# EAGLE design eindwerk board (EAGLE 9.6.2)
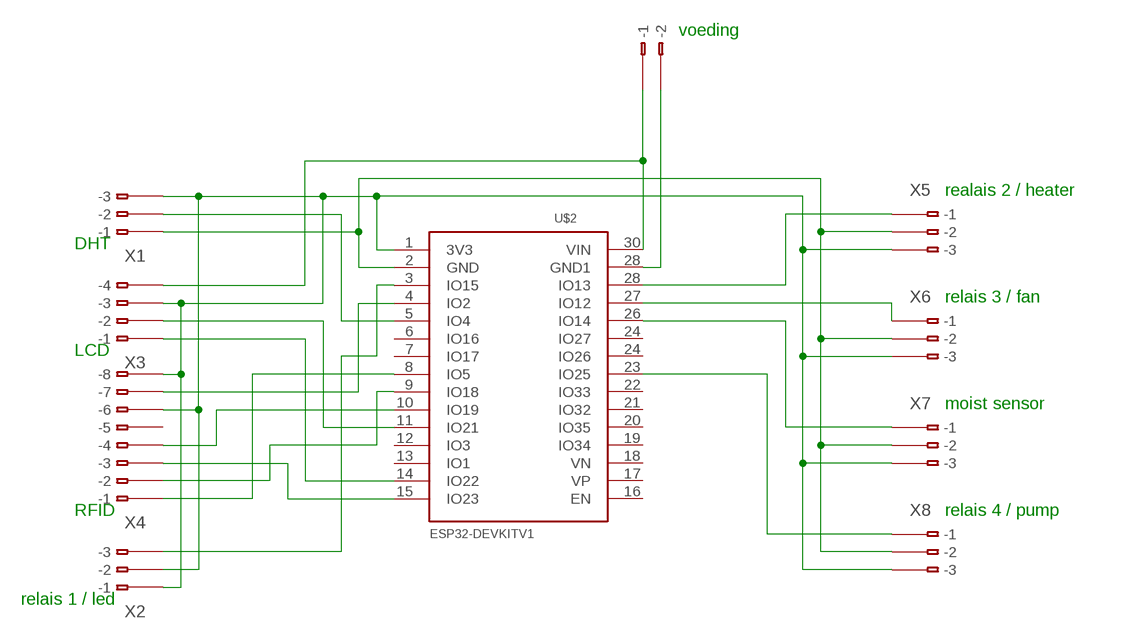
[diagram p0: schematic, sheet 1]

## Parts
U$2  ESP32DEVKITV1  [ESP32-DEVKITV1]
VOEDING  233-102  [233-102]
X1  233-103  [233-103]
X2  233-103  [233-103]
X3  233-104  [233-104]
X4  233-108  [233-108]
X5  233-103  [233-103]
X6  233-103  [233-103]
X7  233-103  [233-103]
X8  233-103  [233-103]

## Nets
N$1: U$2.28(IO13) X5.B1(B-1)
N$2: U$2.2(GND) X1.B1(B-1) X5.B2(B-2) X6.B2(B-2) X7.B2(B-2) X8.B2(B-2)
N$3: U$2.27(IO12) X6.B1(B-1)
N$4: U$2.30(VIN) VOEDING.B1(B-1) X3.B4(B-4)
N$5: U$2.26(IO14) X7.B1(B-1)
N$6: U$2.5(IO4) X1.B2(B-2)
N$7: U$2.4(IO2) X4.B7(B-7)
N$8: U$2.23(IO25) X8.B1(B-1)
N$9: U$2.11(IO21) X3.B2(B-2)
N$10: U$2.14(IO22) X3.B1(B-1)
N$11: U$2.10(IO19) X4.B4(B-4)
N$12: U$2.15(IO23) X4.B3(B-3)
N$13: U$2.9(IO18) X4.B2(B-2)
N$14: U$2.8(IO5) X4.B1(B-1)
N$15: U$2.3(IO15) X2.B3(B-3)
N$16: U$2.1(3V3) X1.B3(B-3) X2.B1(B-1) X2.B2(B-2) X3.B3(B-3) X4.B6(B-6) X4.B8(B-8) X5.B3(B-3) X6.B3(B-3) X7.B3(B-3) X8.B3(B-3)
N$17: U$2.28(GND1) VOEDING.B2(B-2)
Unconnected: U$2.6(IO16) U$2.7(IO17) U$2.12(IO3) U$2.13(IO1) U$2.16(EN) U$2.17(VP) U$2.18(VN) U$2.19(IO34) U$2.20(IO35) U$2.21(IO32) U$2.22(IO33) U$2.24(IO26) U$2.24(IO27) VOEDING.A1(-1) VOEDING.A2(-2) X1.A1(-1) X1.A2(-2) X1.A3(-3) X2.A1(-1) X2.A2(-2) X2.A3(-3) X3.A1(-1) X3.A2(-2) X3.A3(-3) X3.A4(-4) X4.A1(-1) X4.A2(-2) X4.A3(-3) X4.A4(-4) X4.A5(-5) X4.A6(-6) X4.A7(-7) X4.A8(-8) X4.B5(B-5) X5.A1(-1) X5.A2(-2) X5.A3(-3) X6.A1(-1) X6.A2(-2) X6.A3(-3) X7.A1(-1) X7.A2(-2) X7.A3(-3) X8.A1(-1) X8.A2(-2) X8.A3(-3)

## Notes on the sheet
- voeding
- realais 2 / heater
- DHT
- relais 3 / fan
- LCD
- moist sensor
- RFID | relais 4 / pump
- relais 1 / led

## Library data of the parts
U$2 = ESP32-DEVKITV1:ESP32DEVKITV1
VOEDING = con-wago:233-102: WAGO Cage Clamp; MPN: 233-102; OC_FARNELL: unknown; OC_NEWARK: 28K9044
X1 X2 X5-X8 = con-wago:233-103: WAGO Cage Clamp; MPN: 233-103; OC_FARNELL: unknown; OC_NEWARK: 28K9045
X3 = con-wago:233-104: WAGO Cage Clamp; MPN: 233-104; OC_FARNELL: unknown; OC_NEWARK: 28K9046
X4 = con-wago:233-108: WAGO Cage Clamp; MPN: 233-108; OC_FARNELL: unknown; OC_NEWARK: 28K9050

## Board
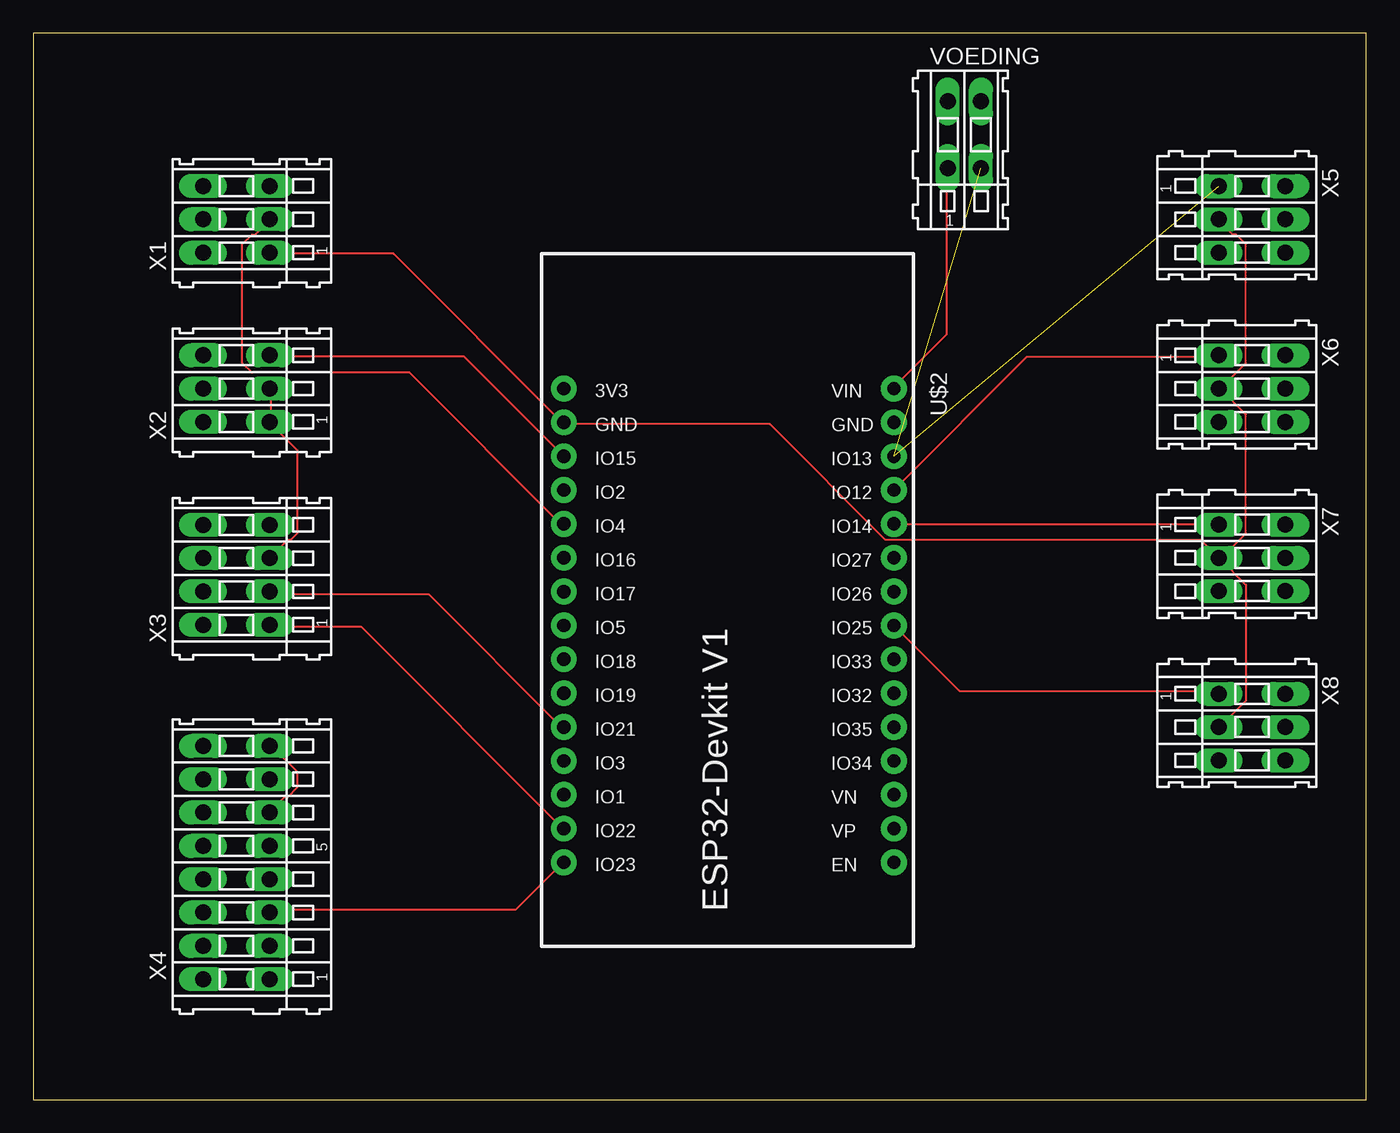
[diagram p1: board, top side]
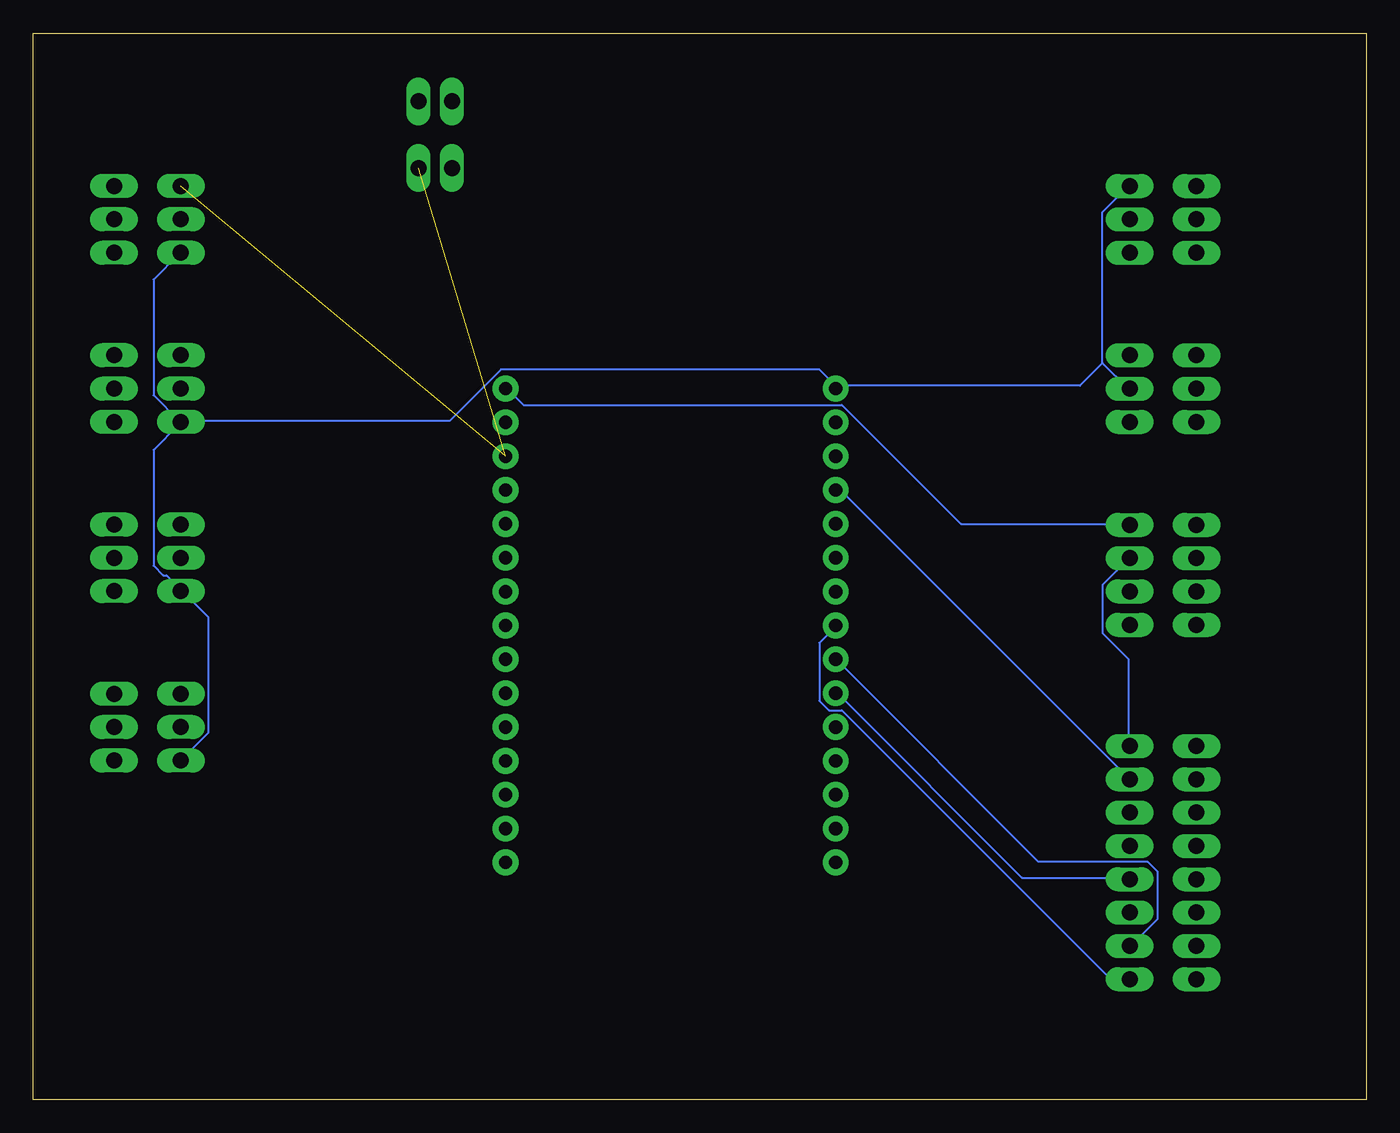
[diagram p2: board, bottom side, seen from below]

Size 100 x 80 mm. Coordinates in mm from the lower left corner, seen from the top.
Outline: 0,0 100,0 100,80 0,80 0,0
Copper layers (1*16): Top 0.035mm / dielectric 1.5mm / Bottom 0.035mm
Design rules "default *": minimum track width 6mil, minimum drill 0.35mm, track to track 13mil, track to pad 6mil, pad to pad 6mil, via to via 6mil, smd to smd 6mil, copper to edge 40mil, drill to drill 6mil, minimum pad ring 10mil, minimum via ring 8mil, stop-mask expansion 4mil, vias tented up to drill 0mil, thermal gap 10mil

### Footprints (pad centres in the part's own frame; a part is rotated, then mirrored left to right if it is on the bottom)
ESP32-DEVKITV1 = drill 1 pad 1.93: 1 -22.87,-13.54; 2 -20.33,-13.54; 3 -17.79,-13.54; 4 -15.25,-13.54; 5 -12.71,-13.54; 6 -10.17,-13.54; 7 -7.63,-13.54; 8 -5.09,-13.54; 9 -2.55,-13.54; 10 -0.01,-13.54; 11 2.53,-13.54; 12 5.07,-13.54; 13 7.61,-13.54; 14 10.15,-13.54; 15 12.69,-13.54; 16 12.69,11.23; 17 10.15,11.23; 18 7.61,11.23; 19 5.07,11.23; 20 2.53,11.23; 21 -0.01,11.23; 22 -2.55,11.23; 23 -5.09,11.23; 24 -7.63,11.23; 25 -10.17,11.23; 26 -12.71,11.23; 27 -15.25,11.23; 28 -17.79,11.23; 29 -20.33,11.23; 30 -22.87,11.23
233-102 = drill 1.2 long: A1 -1.25,2.5; A2 1.25,2.5; B1 -1.25,-2.5; B2 1.25,-2.5
233-103 = drill 1.2 long: A1 -2.5,2.5; A2 0,2.5; A3 2.5,2.5; B1 -2.5,-2.5; B2 0,-2.5; B3 2.5,-2.5
233-104 = drill 1.2 long: A1 -3.75,2.5; A2 -1.25,2.5; A3 1.25,2.5; A4 3.75,2.5; B1 -3.75,-2.5; B2 -1.25,-2.5; B3 1.25,-2.5; B4 3.75,-2.5
233-108 = drill 1.2 long: A1 -8.75,2.5; A2 -6.25,2.5; A3 -3.75,2.5; A4 -1.25,2.5; A5 1.25,2.5; A6 3.75,2.5; A7 6.25,2.5; A8 8.75,2.5; B1 -8.75,-2.5; B2 -6.25,-2.5; B3 -3.75,-2.5; B4 -1.25,-2.5; B5 1.25,-2.5; B6 3.75,-2.5; B7 6.25,-2.5; B8 8.75,-2.5

### Placement (x,y rotation side)
U$2  53.34,30.48 270 top
VOEDING  69.85,72.39 0 top
X1  15.24,66.04 90 top
X2  15.24,53.34 90 top
X3  15.24,39.37 90 top
X4  15.24,17.78 90 top
X5  91.44,66.04 270 top
X6  91.44,53.34 270 top
X7  91.44,40.64 270 top
X8  91.44,27.94 270 top

### Tracks (layer width: path | path; a pad name or v marks a point on that pad's centre or on a via)
N$1  (1 unrouted)
N$2
  Top 0.152: X1.B1 17.86,63.46 27.03,63.46 39.57,50.91 U$2.2 39.81,50.67 55.26,50.67 63.94,41.99 87.59,41.99 88.8,40.78 X7.B2 89.04,40.54 | 89.04,40.54 90.97,38.61 90.97,29.92 89.04,27.99 X8.B2 | 89.04,53.33 90.97,51.4 90.97,42.47 89.04,40.54 | 89.04,53.33 90.97,55.26 90.97,64.19 90.25,64.91 90,64.91 89.04,65.88 X5.B2 | 89.04,53.33 X6.B2
N$3
  Top 0.152: X6.B1 88.8,55.74 74.56,55.74 64.67,45.85 U$2.27
N$4
  Top 0.152: VOEDING.B1 68.53,69.74 68.53,57.43 64.67,53.57 U$2.30
  Bottom 0.152: X3.B4 17.86,43.19 30.4,43.19 39.33,52.12 63.22,52.12 64.43,53.33 U$2.30
N$5
  Top 0.152: X7.B1 88.8,43.19 64.67,43.19 U$2.26
N$6
  Top 0.152: X1.B2 17.61,65.88 16.65,64.91 16.41,64.91 15.68,64.19 15.68,55.26 16.41,54.53 28.23,54.53 39.57,43.19 U$2.5
N$7
  Bottom 0.152: X4.B7 17.86,24.13 39.57,45.85 U$2.4
N$8
  Top 0.152: X8.B1 88.8,30.64 69.49,30.64 64.67,35.47 U$2.23
N$9
  Top 0.152: X3.B2 17.86,37.88 29.68,37.88 39.57,27.99 U$2.11
N$10
  Top 0.152: X3.B1 17.86,35.47 24.61,35.47 39.57,20.51 U$2.14
N$11
  Bottom 0.152: X4.B4 17.86,16.65 25.82,16.65 39.57,30.4 U$2.10
N$12
  Top 0.152: X4.B3 17.86,14.24 36.2,14.24 39.57,17.61 U$2.15
N$13
  Bottom 0.152: X4.B2 17.61,11.58 15.68,13.51 15.68,17.13 16.41,17.86 24.61,17.86 39.57,32.82 U$2.9
N$14
  Bottom 0.152: X4.B1 17.86,9.17 19.3,9.17 39.33,29.2 40.3,29.2 41.02,29.92 41.02,34.27 39.81,35.47 U$2.8
N$15
  Top 0.152: X2.B3 17.86,55.74 32.33,55.74 39.57,48.5 U$2.3
N$16
  Top 0.152: X4.B6 17.86,21.72 18.82,22.68 19.06,22.68 19.79,23.41 19.79,24.61 17.86,26.54 X4.B8 | X3.B3 17.86,40.78 19.06,41.99 19.3,41.99 19.79,42.47 19.79,48.74 17.86,50.67 X2.B1 17.86,50.91 17.86,53.33 X2.B2
  Bottom 0.152: X8.B3 88.8,25.58 86.87,27.51 86.87,36.2 88.8,38.12 X7.B3 89.04,38.37 90,39.33 90.25,39.33 90.97,40.06 90.97,48.74 89.04,50.67 X6.B3 | X6.B3 89.04,50.91 90.97,52.84 90.97,61.53 89.04,63.46 X5.B3 | 19.79,55.26 19.79,66.6 17.86,68.53 X1.B3 | 19.79,55.26 17.86,53.33 X2.B2 | 19.79,55.26 21.48,53.57 39.57,53.57 U$2.1 39.81,53.57 41.02,54.77 64.91,54.77 68.77,50.91 88.8,50.91 X6.B3 | X4.B8 17.86,26.54 17.86,33.06 19.79,34.99 19.79,38.61 17.86,40.54 X3.B3
N$17  (1 unrouted)